# Altium project DoorCard_v0.1.PrjPcb
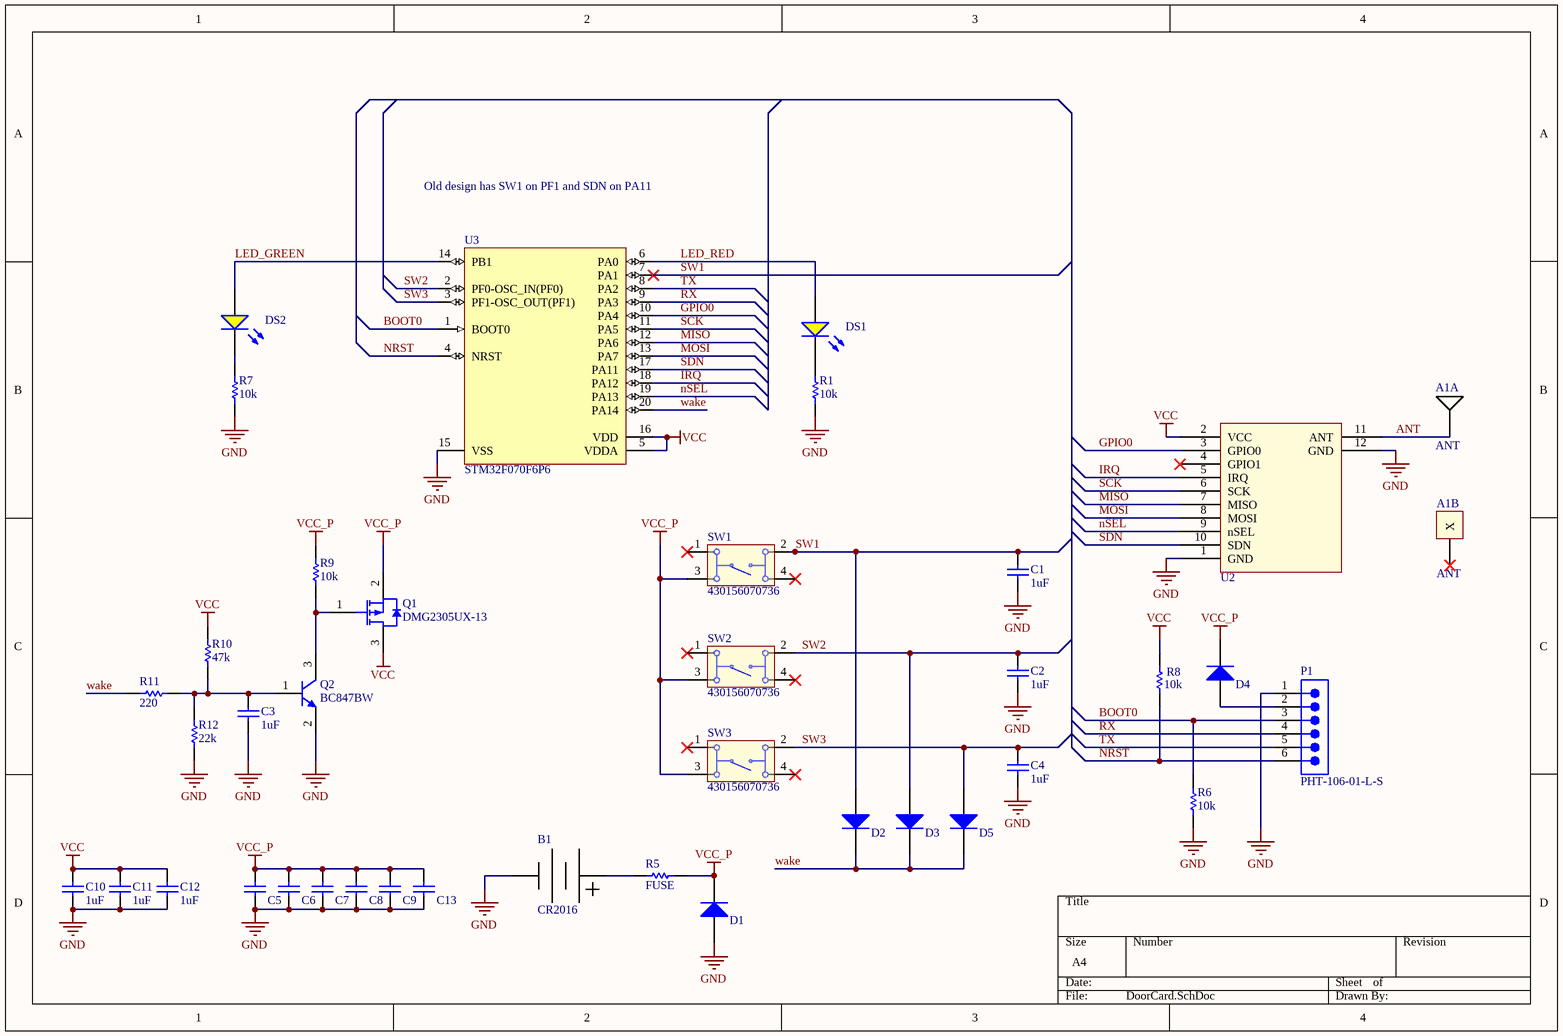
[diagram p0: DoorCard.SchDoc]
1 sheet, 39 parts. Net scope: global (net labels, ports and power ports of the same name join across sheets).
Board file: doorCard.PcbDoc

## Sheet DoorCard.SchDoc
size A4

### Parts
A1  ANT  [433MHz_Antenna]  (parts A,B of 2)
B1  CR2016  [CR2012]
C1  1uF  [CAPC0805(2012)100_M]
C2  1uF  [CAPC0805(2012)100_M]
C3  1uF  [CAPC0805(2012)100_M]
C4  1uF  [CAPC0805(2012)100_M]
C5  CAP 47uF 6.3V 1206(3216)  [CAPC1206(3216)190_M]  (value not drawn)
C6  CAP 47uF 6.3V 1206(3216)  [CAPC1206(3216)190_M]  (value not drawn)
C7  CAP 47uF 6.3V 1206(3216)  [CAPC1206(3216)190_M]  (value not drawn)
C8  CAP 47uF 6.3V 1206(3216)  [CAPC1206(3216)190_M]  (value not drawn)
C9  CAP 47uF 6.3V 1206(3216)  [CAPC1206(3216)190_M]  (value not drawn)
C10  1uF  [CAPC0805(2012)100_M]
C11  1uF  [CAPC0805(2012)100_M]
C12  1uF  [CAPC0805(2012)100_M]
C13  CAP 47uF 6.3V 1206(3216)  [CAPC1206(3216)190_M]  (value not drawn)
D1  MMSD4148T3G  [ONSC-SOD123-2-425G-04_V]  (value not drawn)
D2  MMSD4148T3G  [ONSC-SOD123-2-425G-04_V]  (value not drawn)
D3  MMSD4148T3G  [ONSC-SOD123-2-425G-04_V]  (value not drawn)
D4  MMSD4148T3G  [ONSC-SOD123-2-425G-04_V]  (value not drawn)
D5  MMSD4148T3G  [ONSC-SOD123-2-425G-04_V]  (value not drawn)
DS1  LTST-C170YKT  [LTST-C170YKT_V]  (value not drawn)
DS2  LTST-C170YKT  [LTST-C170YKT_V]  (value not drawn)
P1  PHT-106-01-L-S  [SMTC-PHT-106-01-X-S]
Q1  DMG2305UX-13  [FAIR-SOT23-3_V]
Q2  BC847BW  [INF-SOT323_N]
R1  10k  [RESC0805(2012)_L]
R5  FUSE  [RESC0805(2012)_L]
R6  10k  [RESC0805(2012)_L]
R7  10k  [RESC0805(2012)_L]
R8  10k  [RESC0805(2012)_L]
R9  10k  [RESC0805(2012)_L]
R10  47k  [RESC0805(2012)_L]
R11  220  [RESC0805(2012)_L]
R12  22k  [RESC0805(2012)_L]
SW1  430156070736  [430156070736]
SW2  430156070736  [430156070736]
SW3  430156070736  [430156070736]
U2  Si4463  [E10-433MS]  (value not drawn)
U3  STM32F070F6P6  [STM-TSSOP20_M]

### Nets
GND: B1.2 C1.1 C2.1 C3.1 C4.1 C5.1 C6.1 C7.1 C8.1 C9.1 C10.1 C11.1 C12.1 C13.1 D1.2(ANODE) P1.1 Q2.2(E) R1.1 R6.1 R7.1 R12.1 U2.1(GND) U2.12(GND) U3.15(VSS)
VCC: C10.2 C11.2 C12.2 Q1.3(DRAIN) R8.2 R10.2 U2.2(VCC) U3.5(VDDA) U3.16(VDD)
VCC_P: C5.2 C6.2 C7.2 C8.2 C9.2 C13.2 D1.1(CATHODE) D4.1(CATHODE) Q1.2(SOURCE) R5.1 R9.2 SW1.3 SW2.3 SW3.3
ANT: A1.1(ANT) U2.11(ANT)
BOOT0: P1.3 R6.2 U3.1(BOOT0)
GPIO0: U2.3(GPIO0) U3.10(PA4)
IRQ: U2.5(IRQ) U3.18(PA12)
LED_GREEN: DS2.A U3.14(PB1)
LED_RED: DS1.A U3.6(PA0)
MISO: U2.7(MISO) U3.12(PA6)
MOSI: U2.8(MOSI) U3.13(PA7)
NRST: P1.6 R8.1 U3.4(NRST)
nSEL: U2.9(nSEL) U3.19(PA13)
RX: P1.4 U3.9(PA3)
SCK: U2.6(SCK) U3.11(PA5)
SDN: U2.10(SDN) U3.17(PA11)
SW1: C1.2 D2.2(ANODE) SW1.2 U3.7(PA1)
SW2: C2.2 D3.2(ANODE) SW2.2 U3.2(PF0-OSC_IN(PF0))
SW3: C4.2 D5.2(ANODE) SW3.2 U3.3(PF1-OSC_OUT(PF1))
TX: P1.5 U3.8(PA2)
wake: D2.1(CATHODE) D3.1(CATHODE) D5.1(CATHODE) R11.2 U3.20(PA14)
NetB1_1: B1.1 R5.2
NetC3_2: C3.2 Q2.1(B) R10.1 R11.1 R12.2
NetD4_2: D4.2(ANODE) P1.2
NetDS1_C: DS1.C R1.2
NetDS2_C: DS2.C R7.2
NetQ1_1: Q1.1(GATE) Q2.3(C) R9.1

Not connected (* = marked no-connect by the designer): A1 2(X)*; SW1 1* 4*; SW2 1* 4*; SW3 1* 4*; U2 4(GPIO1)*

### Notes on the sheet
- Old design has SW1 on PF1 and SDN on PA11

### Library data of the parts
A1 = ANT1204F002R0433A
B1 = BAT-HLD-002-SMT
C1-C4 C10-C12 = CMP-1036-04754-1: CAP 1uF 25V ±10% 0805 (2012 Metric) Thickness 1mm SMD; Case-EIA: 0805; Case-Metric: 2012; Tolerance: Â±10%; Max Thickness: 1 mm; Value: 1uF; Rated Voltage: 25 V; Technology: SMT
C5-C9 C13 = CMP-1037-05000-1: CAP 47uF 6.3V ±20% 1206 (3216 Metric) Thickness 1.9mm SMD; Case-EIA: 1206; Case-Metric: 3216; Tolerance: Â±20%; Max Thickness: 1.9 mm; Value: 47uF; Technology: SMT; Rated Voltage: 6.3 V
D1-D5 = CMP-0895-00002-1: Switching Diode, 100 V, 200 mA, -55 to 150 degC, 2-Pin SOD123 (425), RoHS, Tape and Reel; Manufacturer: ON Semiconductor; CD (Max): 4 pF; IR @ VR: 75 V (Max)=50 uA; PD (Max): 425 mW; VF (Max): 1 A; Trr (Max): 4 ns; VBR (Min): 100 V; ComponentLink1URL: http://www.onsemi.com/; ComponentLink1Description: Manufacturer URL; PackageReference: SOD123-2-425G-04; PackageDescription: 2-Pin SOD123, Body 2.69 x 1.6 mm, Height 1.35 mm; ComponentLink2Description: Datasheet; Mounting Technology: Surface Mount; RoHS: TRUE; PartNumber: MMSD4148T3G; PackageVersion: Rev. 04G; DatasheetVersion: Rev. 11; Temperature Range: -55 to 150 degC; ComponentLink3Description: Package Specification; Packing: Tape and Reel; ComponentLink3URL: http://www.onsemi.com/pub_link/Collateral/425-04.PDF; ComponentLink2URL: http://www.onsemi.com/pub_link/Collateral/MMSD4148T1-D.PDF
DS1 DS2 = CMP-1674-00003-2: LED YELLOW CLEAR 0805 SMD; ComponentLink1Description: Datasheet; PackageReference: C170YKT; ComponentLink1URL: http://media.digikey.com/pdf/Data Sheets/Lite-On PDFs/LTST-C170YKT.pdf; PartNumber: LTST-C170YKT
P1 = CMP-1024-00187-1: Press Fit Header, Through-hole, Vertical, -55 to 125 degC, 2.54 mm Pitch, 6-Pin, Male, RoHS; Manufacturer: Samtec; Pitch: 2.54 mm; PackageReference: PHT-106-01-X-S; PackageDescription: .100 Press Fit Socket Assembly; ComponentLink3URL: http://www.samtec.com/documents/webfiles/cpdf/PHT-1XX-XX-X-X-XXX-MKT.pdf; PackageVersion: J, 9/2009; ComponentLink3Description: Package Specification; PartNumber: PHT-106-01-L-S; ComponentLink1Description: Manufacturer URL; Orientation: Vertical; Mounting Technology: Through-hole; ComponentLink1URL: http://www.samtec.com; ComponentLink2URL: http://www.samtec.com/documents/webfiles/pdf/pht.pdf; Temperature Range: -55 to 125 degC; RoHS: True; DatasheetVersion: F-214; ComponentLink2Description: Datasheet
Q1 = CMP-1670-00012-1: Capacitance: 1.8E-11 f; ESR: 100 Ohm; Frequency Tolerance: 30ppm; Load Capacitance: 18 pF; Frequency: 8 MHz; Width: 3.2 mm; Length: 5 mm; RoHSCompliant: True; Mount: Surface Mount; Packaging: Tape and Reel; ComponentLink3URL: http://www.fairchildsemi.com/dwg/MA/MA03D.pdf; REACH SVHC: Unknown; ComponentLink3Description: Package Specification; Resistance: 100 Ohm; Package Quantity: 1000; Max Operating Temperature: 70degC; ComponentLink2URL: https://www.fairchildsemi.com/datasheets/BS/BSS84.pdf; PackageReference: SOT23-3; ComponentLink1URL: https://www.fairchildsemi.com/; Tolerance: 30ppm; PackageDescription: 3-Pin Small Outline Transistor, Body 2.92 x 1.325 mm, Pitch 0.95 mm; ComponentLink2Description: Datasheet; Min Operating Temperature: -20degC; ComponentLink1Description: Manufacturer URL; DatasheetVersion: Rev. 1.1.0, 02/2013; Height: 1.2 mm; Pins: 4
Q2 = CMP-1177-00080-1: NPN Silicon AF Transistor, 45 V VCEO, 100 mA IC, SOT323, Reel, Green; Manufacturer: Infineon; VCEO (max): 45Â V; ICBO (max): 15Â nA; IBM (max): 200Â mA; Ptot (max): 250Â mW; Green: TRUE; VEBO (max): 6Â V; IC (max): 100Â mA; VCBO (max): 50Â V; fT (typ): 250Â MHz; Halogen-free: TRUE; Packing: Reel; Mounting Technology: Surface Mount; PackageReference: SOT323; PartNumber: BC847BW; PackageDescription: 3-Pin Small Outline Transistor Package, 1.25 x 2 mm Body, 0.65 mm Pitch; ICM (max): 200Â mA; ComponentLink3Description: Package Specification; ComponentLink1URL: http://www.infineon.com/; ComponentLink2Description: Datasheet; Polarity: NPN; ComponentLink2URL: http://www.infineon.com/dgdl/bc847series_bc848series_bc849series_bc850series.pdf?folderId=db3a304314dca389011541d30fa21656&fileId=db3a304314dca389011541d4630a1657; ComponentLink1Description: Manufacturer URL; ComponentLink3URL: http://www.infineon.com/dgdl/SOT323-Package_Overview.pdf?folderId=db3a30431936bc4b0119533e1dcb3c92&fileId=db3a30431936bc4b011953495f283cb1
R1 R6-R12 = CMP-1013-00624-1: 10K2 0.125W 1% 0805 (2012 Metric)  SMD; Case-Metric: 2012; Case-EIA: 0805; Value: 10200.00 Ohm; Technology: SMT; Tolerance: 1 %; Power: 0.125 W
R5 = CMP-1013-00624-1: PTC Fuse; Case-Metric: 2012; Case-EIA: 0805; Value: 10200.00 Ohm; Tolerance: 1 %; Power: 0.125 W; Technology: SMT
SW1-SW3 = CMP-1453-00006-1: WS-TATV THT Tact Switch 6X6 mm; Manufacturer: Wuerth Elektronik; NoPins: 04; ComponentLink2URL: http://katalog.we-online.de/em/datasheet/4301x6.pdf; ComponentLink1Description: Manufacturer URL; PackageReference: 430156070736; ComponentLink2Description: Datasheet; PartNumber: 430156070736; ComponentLink1URL: http://www.we-online.com
U2 = Component_1: E10-433MS
U3 = CMP-0304-00145-2: ARM Cortex-M0 32-bit MCU, 32 KB Flash, 6 KB Internal RAM, 15 I/Os, 20-Pin TSSOP, -40 to 85 degC, Tray; Manufacturer: STMicroelectronics; FLASH Size (Prog) (kB): 32; Internal RAM Size (kB): 6; Operating Frequency(F) (Processor speed) (MHz): 48; Supply Voltage(Vcc) min (V): 2.4; I/Os (High Current): 15; ComponentLink2URL: http://www.st.com/st-web-ui/static/active/en/resource/technical/document/datasheet/DM00141386.pdf; ComponentLink2Description: Datasheet; Packing: Tray; DatasheetVersion: Rev. 3; PartNumber: STM32F070F6P6; Core: ARM Cortex-M0; Package Reference: TSSOP20; Package Description: 20-Pin Thin Shrink Small Outline Package, Body 6.5 x 4.4 mm, Pitch 0.65 mm; ComponentLink1Description: Manufacturer URL; ComponentLink1URL: http://www.st.com/; Mounting Technology: Surface Mount